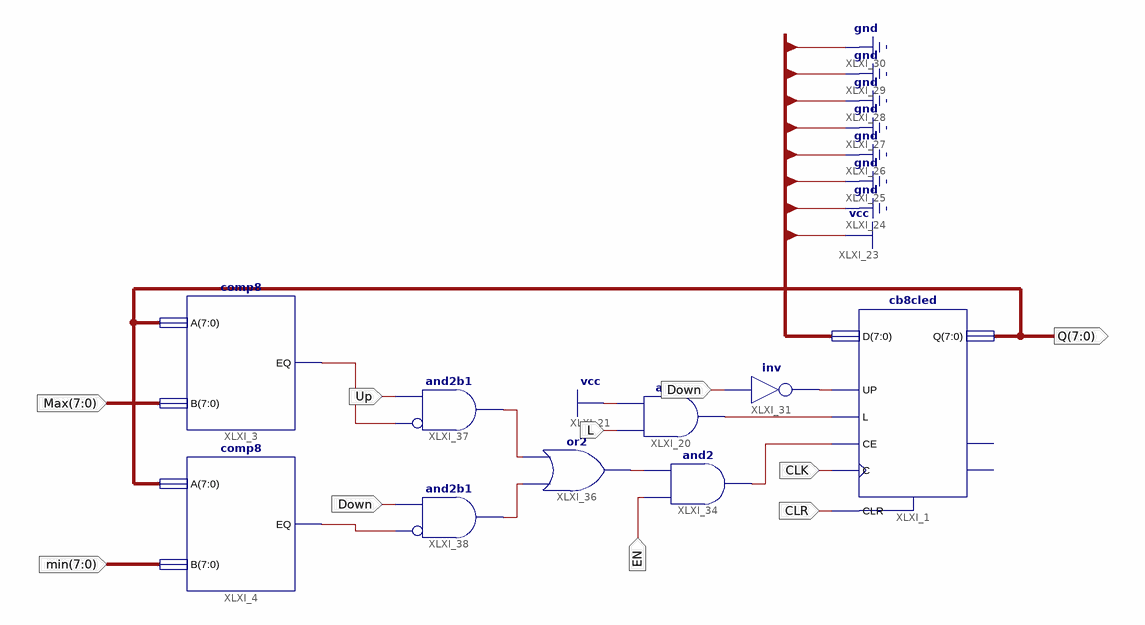
[diagram p0: schematic sheet 1]
// Xilinx ISE schematic Updown_design.sch (spartan3) as structural Verilog: 9 symbols, 9 ports
module Updown_design (
  input  L,
  input  CLK,
  input  CLR,
  input  EN,
  input  [7:0] Max,
  input  [7:0] min,
  input  Down,
  input  Up,
  output [7:0] Q
);

  wire XLXN_18, XLXN_49, XLXN_57, XLXN_58, XLXN_67, XLXN_69, XLXN_70, XLXN_71;

  comp8 XLXI_3 (.A(Q), .B(Max), .EQ(XLXN_71));
  comp8 XLXI_4 (.A(Q), .B(min), .EQ(XLXN_70));
  cb8cled XLXI_1 (
    .C(CLK), .CE(XLXN_58), .CLR(CLR), .D(8'b00000001), .L(XLXN_18), .UP(XLXN_49), .Q(Q));  // open: CEO, TC
  and XLXI_20 (XLXN_18, L, 1'b1);
  not XLXI_31 (XLXN_49, Down);
  and XLXI_34 (XLXN_58, EN, XLXN_57);
  or XLXI_36 (XLXN_57, XLXN_69, XLXN_67);
  and XLXI_37 (XLXN_67, ~XLXN_71, Up);  // and2b1
  and XLXI_38 (XLXN_69, ~XLXN_70, Down);  // and2b1
endmodule
